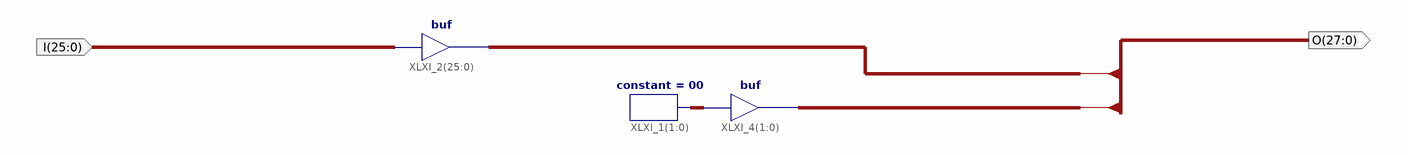
[diagram p0: schematic sheet 1]
// Xilinx ISE schematic shift_left_jmp.sch (spartan3) as structural Verilog: 3 symbols, 2 ports
module shift_left_jmp (
  input  [25:0] I,
  output [27:0] O
);

  wire [1:0] XLXN_1;

  assign O[27:2] = I;  // buf XLXI_2[25..0], 26 bits wide
  constant #(.CValue("00")) XLXI_1[1:0] (.O(XLXN_1));
  assign O[1:0] = XLXN_1;  // buf XLXI_4[1..0], 2 bits wide
endmodule
